# EAGLE design SkyKontrol-smartDisplay (EAGLE 9.5.2)
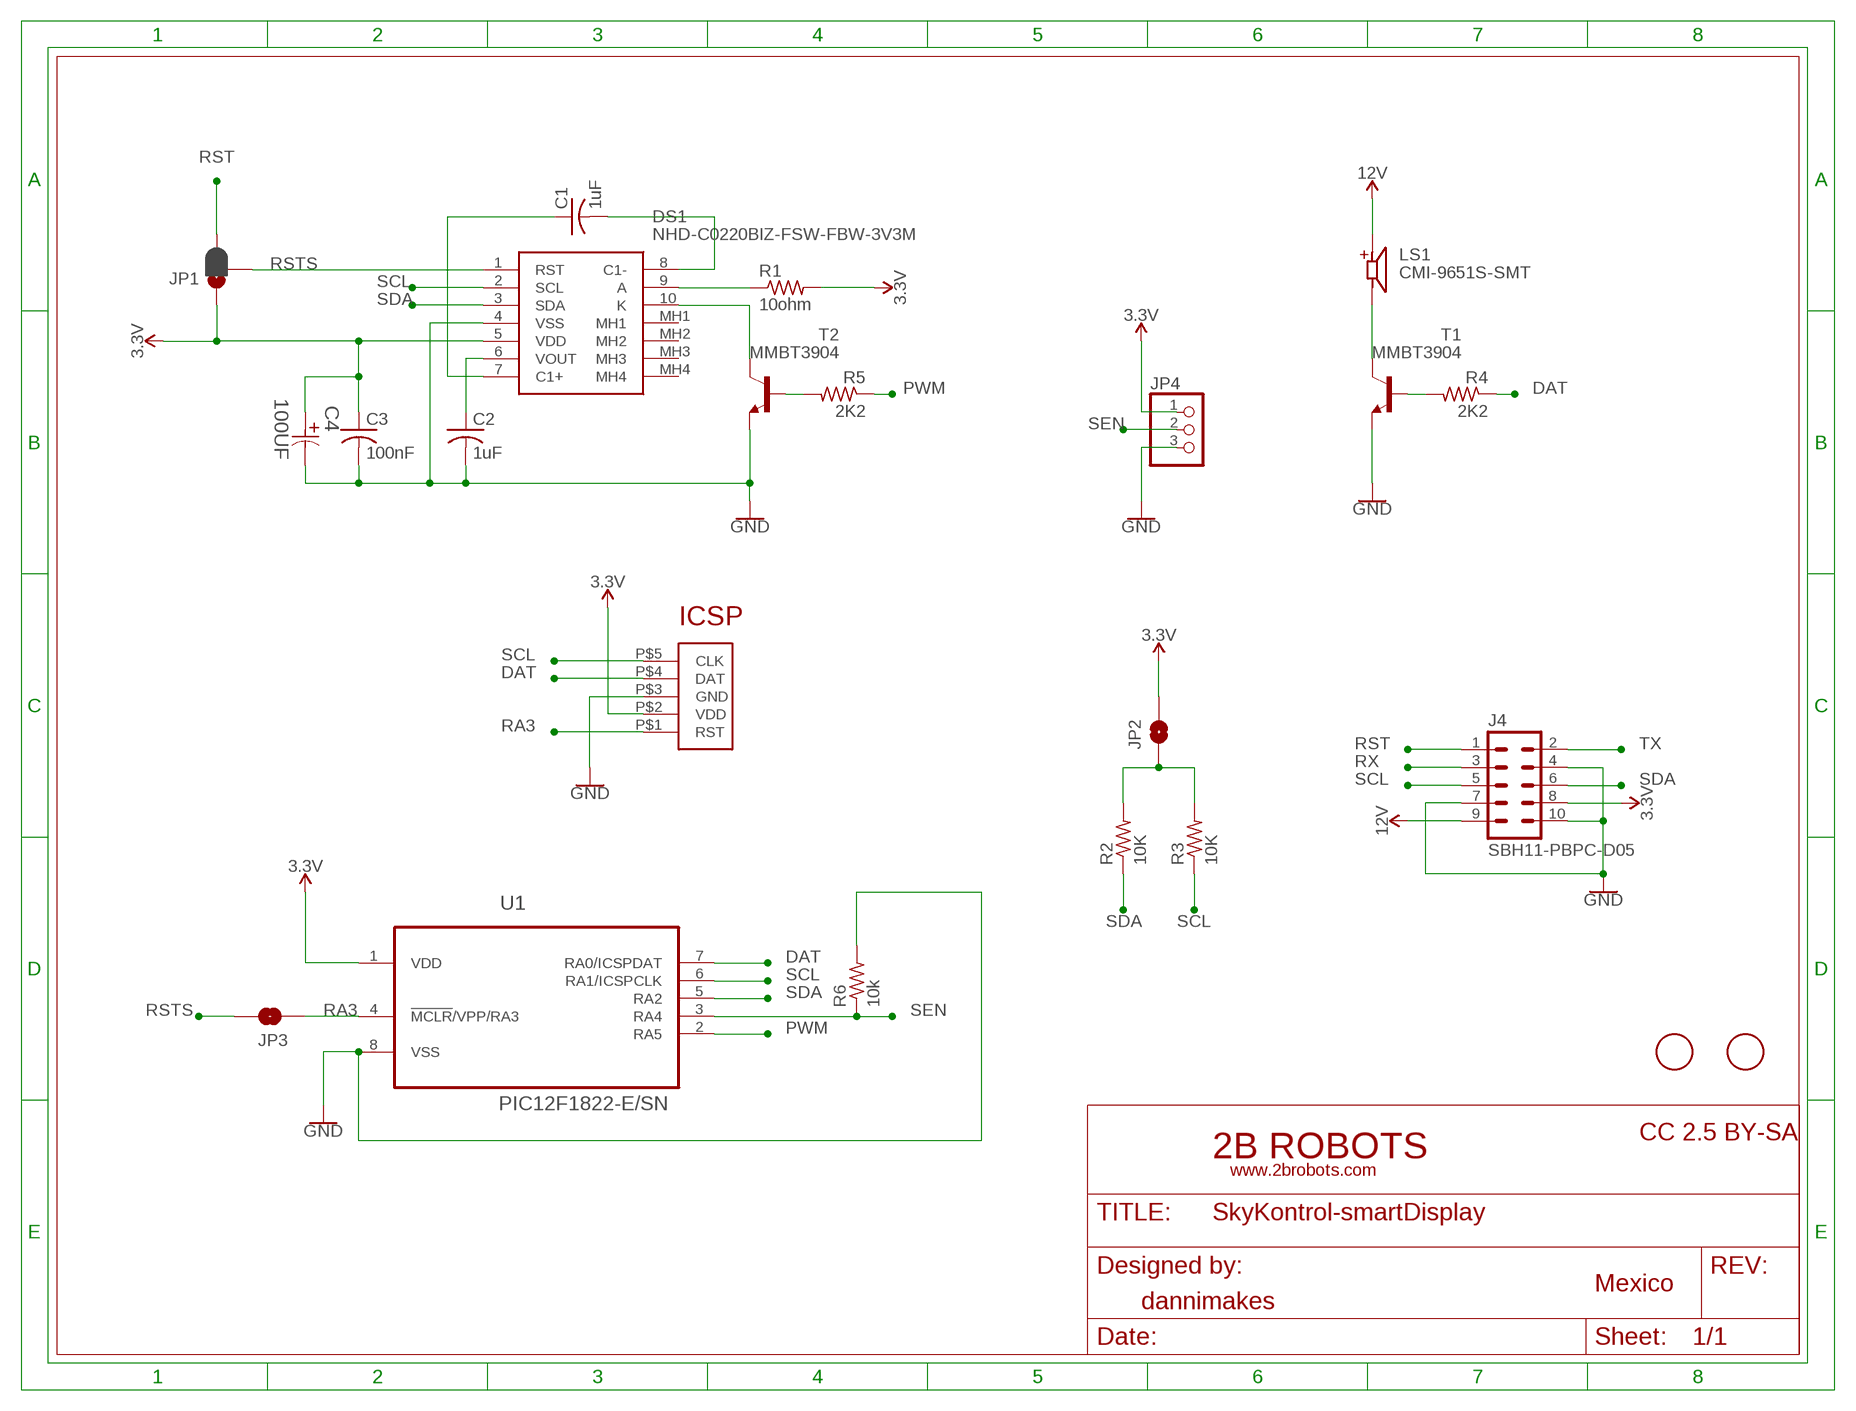
[diagram p0: schematic, sheet 1]

## Parts
C1  1uF  C-USC0603K  [C0603K]
C2  1uF  C-USC0603K  [C0603K]
C3  100nF  C-USC0603K  [C0603K]
C4  100UF  EEE-HA1E101XP-CASE-D8  [CAPAE660X800N]
DS1  NHD-C0220BIZ-FSW-FBW-3V3M  [NHDC0220BIZFSWFBW3V3M]
J4  SBH11-PBPC-D05  [SBH11-PBPC-D05]
JP1  JUMPER-SMT_3_1-NC_PASTE_SILK  [SMT-JUMPER_3_1-NC_PASTE_SILK]
JP2  JUMPER-SMT_2_NO_SILK  [SMT-JUMPER_2_NO_SILK]
JP3  JUMPER-SMT_2_NO_SILK  [SMT-JUMPER_2_NO_SILK]
JP4  PINHD-1X3CB  [1X03-CLEANBIG]
LS1  CMI-9651S-SMT  [CUI_CMI-9651S-SMT]
R1  10ohm  R-US_R0805  [R0805]
R2  10K  R-US_R0805  [R0805]
R3  10K  R-US_R0805  [R0805]
R4  2K2  R-US_R0805  [R0805]
R5  2K2  R-US_R0805  [R0805]
R6  10k  R-US_R0805  [R0805]
T1  MMBT3904  MMBT3904LT1-NPN-SOT23-BEC  [SOT23-BEC]
T2  MMBT3904  MMBT3904LT1-NPN-SOT23-BEC  [SOT23-BEC]
U1  PIC12F1822-E/SN  [SOIC127P600X175-8N]
U$1  FIDUCIAL  [FIDUCIAL_1MM]
U$2  ICSP_POGO  [ICSP_POGO]
U$3  FIDUCIAL  [FIDUCIAL_1MM]

## Nets
3.3V: C3.1 C4.1 DS1.5(VDD) J4.8 JP1.1 JP2.2 JP4.1 R1.2 U1.1(VDD) U$2.P$2(VDD)
12V: J4.9 LS1.P
DAT: R4.1 U1.7(RA0/ICSPDAT) U$2.P$4(DAT)
GND: C2.2 C3.2 C4.2 DS1.4(VSS) J4.4 J4.7 J4.10 JP4.3 R6.2 T1.E T2.E U1.8(VSS) U$2.P$3(GND)
N$1: C2.1 DS1.6(VOUT)
N$2: C1.2 DS1.8(C1-)
N$3: C1.1 DS1.7(C1+)
N$4: DS1.9(A) R1.1
N$8: JP2.1 R2.2 R3.2
N$10: LS1.N T1.C
N$12: R4.2 T1.B
N$17: DS1.10(K) T2.C
N$19: R5.2 T2.B
PWM: R5.1 U1.2(RA5)
RA3: JP3.1 U1.4(!MCLR!/VPP/RA3) U$2.P$1(RST)
RST: J4.1 JP1.3
RSTS: DS1.1(RST) JP1.2 JP3.2
RX: J4.3
SCL: DS1.2(SCL) J4.5 R3.1 U1.6(RA1/ICSPCLK) U$2.P$5(CLK)
SDA: DS1.3(SDA) J4.6 R2.1 U1.5(RA2)
SEN: JP4.2 R6.1 U1.3(RA4)
TX: J4.2
Unconnected: DS1.MH1 DS1.MH2 DS1.MH3 DS1.MH4

## Library data of the parts
C1-C3 = adafruit:C-US: CAPACITOR, American symbol
C4 = Panasonic-EEEFT_EEEH:EEE-: Aluminum Electrolytic Capacitors,Surface Mount Type; MPN: EEE-HA1E101XP; OC_FARNELL: 1973328; OC_NEWARK: 58T9236; PACKAGE: CASE-D8; SUPPLIER: PANASONIC; TOLERANCE: ±20 %; VOLTAGERATING: 25V
DS1 = NHD-C0220BIZ-FSW-FBW-3V3M:NHD-C0220BIZ-FSW-FBW-3V3M: LCD Character Display Modules & Accessories 2 x 20 FSTN (+) Transf White LED Source: Datasheet <https://componentsearchengine.com/Datasheets/1/NHD-C0220BiZ-FSW-FBW-3V3M.pdf>; DESCRIPTION: LCD Character Display Modules & Accessories 2 x 20 FSTN (+) Transf White LED; HEIGHT: 7mm; MANUFACTURER_NAME: Newhaven Display; MANUFACTURER_PART_NUMBER: NHD-C0220BIZ-FSW-FBW-3V3M; MOUSER_PART_NUMBER: 763-C0220BIZ-FSW-FBW; MOUSER_PRICE-STOCK: https://www.mouser.com/Search/Refine.aspx?Keyword=763-C0220BIZ-FSW-FBW
J4 = con-sullins:SBH11-PBPC-D05: HEADER - Vertical, Shrouded
JP1 = SparkFun-Jumpers:JUMPER-SMT_3_1-NC_PASTE: Normally closed solder jumper (1 of 2 connections) This jumper has an aperture in the stencil to allow solder paste to bridge one of the two connections. One connection is normally closed (NC), while the other is normally open (NO). Wick off the solder to open the connection. Reapply solder to reclose the connection. Apply solder to the other side instead to change the current path.
JP2 JP3 = SparkFun-Jumpers:JUMPER-SMT_2_NO: Normally open jumper This jumper has two pads in close proximity to each other. Apply solder to close the connection. Round pads are easier to solder for beginners, but are a lot larger. SparkFun Product that uses the round pads: SparkFun EL Sequencer <https://www.sparkfun.com/products/12781>
JP4 = adafruit:PINHD-1X3: PIN HEADER
LS1 = CMI-9651S-SMT:CMI-9651S-SMT: 9.6 mm, 12 Vdc, 90 dB, 2.7 kHz, Surface Mount (SMT), Driving Circuit, Magnetic Audio Indicator Buzzer; MANUFACTURER: CUI INC; PARTREV: 1.0; STANDARD: Manufacturer recommendations
R1-R6 = adafruit:R-US_: RESISTOR, American symbol
T1 T2 = transistor:*-NPN-: NPN Transistror BF959 corrected 2008.03.06
U1 = Microchip-PIC12F1822-E_SN:PIC12F1822-E/SN: 8/14-Pin Flash Microcontrollers,SOIC-8; MPN: PIC12F1822-E/SN; OC_FARNELL: 2315760; OC_NEWARK: 53R0195; PACKAGE: SOIC-8; SUPPLIER: Microchip
U$1 U$3 = adafruit:FIDUCIAL: For use by pick and place machines to calibrate the vision/machine, 1mm By microbuilder.eu
U$2 = ICSP_POGO:ICSP_POGO

## Board
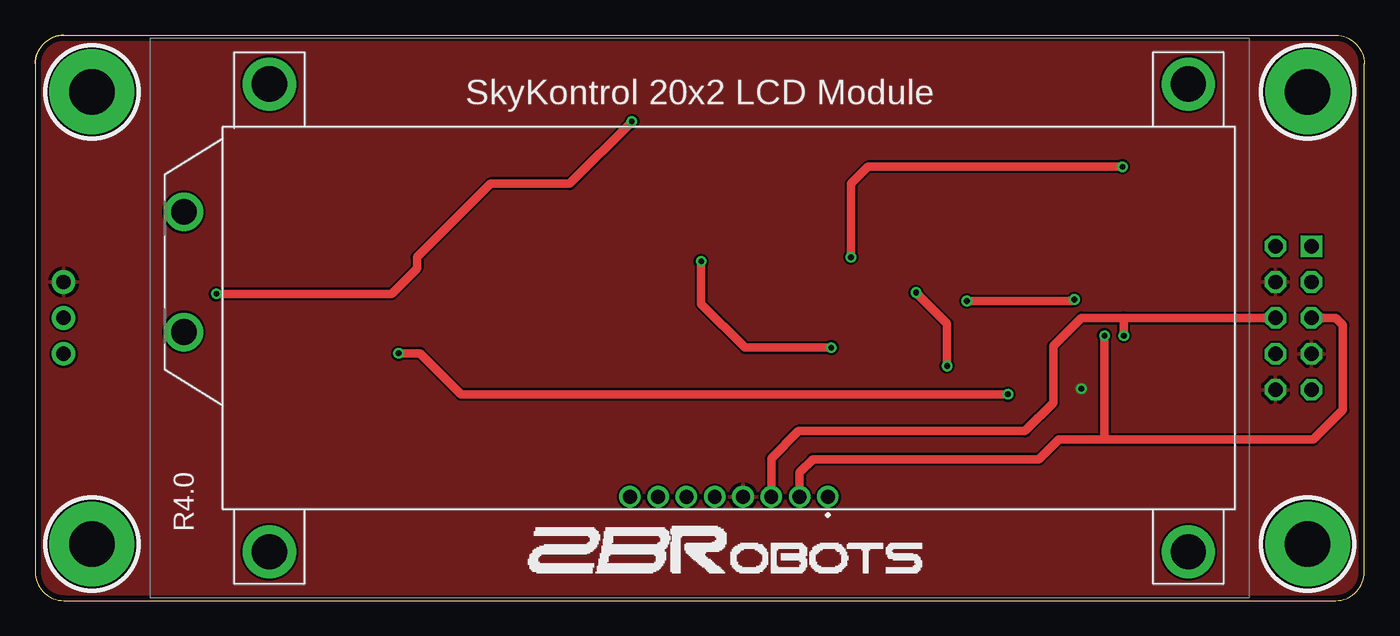
[diagram p1: board, top side]
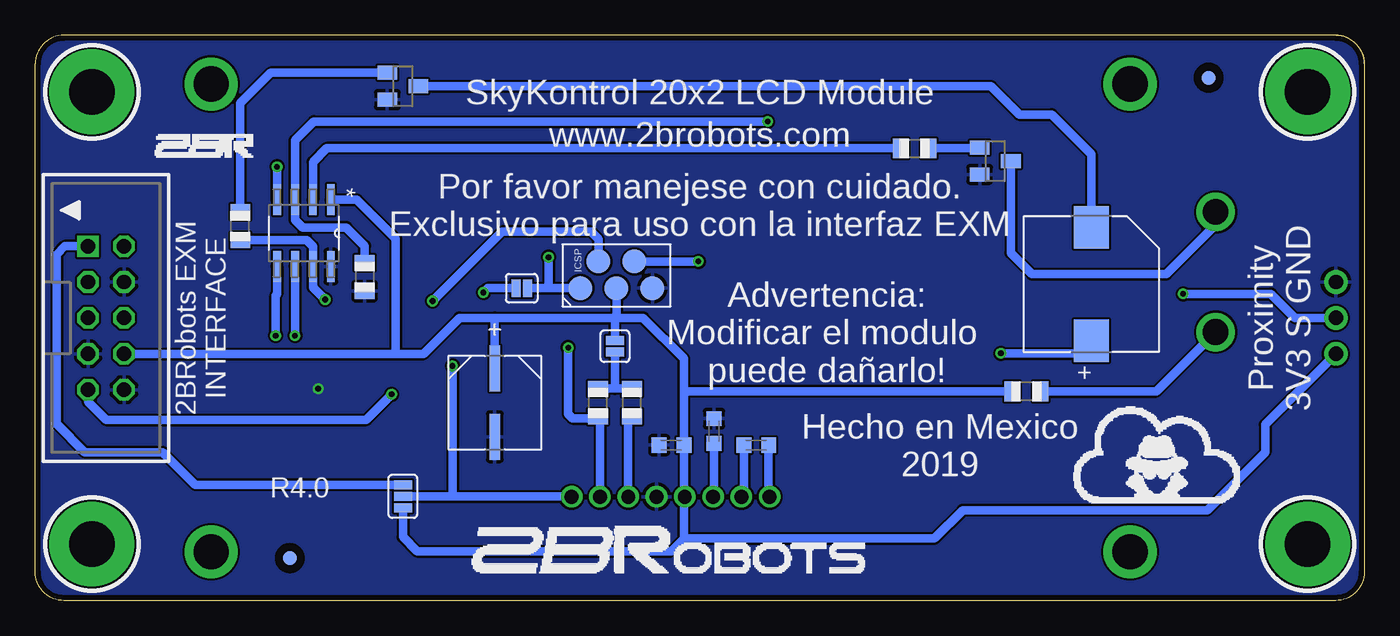
[diagram p2: board, bottom side, seen from below]

Size 94 x 40 mm. Coordinates in mm from the lower left corner, seen from the top.
Outline: 0,38 0,2 arc90 2,0 92,0 arc90 94,2 94,38 arc90 92,40 2,40
Outline: 2,40 arc90 0,38
Outline: 0,38 arc-90 2,40
Copper layers (1*16): Top 0.0356mm / dielectric 1.5011mm / Bottom 0.0356mm
Design rules "2brobots-2layer": minimum track width 6mil, minimum drill 0.3mm, track to track 6mil, track to pad 6mil, pad to pad 6mil, via to via 6mil, smd to smd 6mil, copper to edge 15mil, drill to drill 6mil, minimum pad ring 7mil, minimum via ring 7mil, stop-mask expansion 2.5mil, vias tented up to drill 50mil, thermal gap 10mil

### Footprints (pad centres in the part's own frame; a part is rotated, then mirrored left to right if it is on the bottom)
C0603K = smd 1.05 x 1.08: 1 -0.875,0; 2 0.875,0
CAPAE660X800N = smd 3.251 x 0.762: 1 -2.413,0; 2 2.413,0
NHDC0220BIZFSWFBW3V3M = drill 0.98 pad 1.524: 1 9.058,-12.65; 2 7.058,-12.65; 3 5.058,-12.65; 4 3.058,-12.65; 5 1.058,-12.65; 6 -0.942,-12.65; 7 -2.942,-12.65; 8 -4.942,-12.65 | drill 1.82 pad 2.73: 9 -36.492,-1; 10 -36.492,7.5 | drill 2.5 pad 3.75: MH1 -30.442,-16.55; MH2 34.558,-16.55; MH3 -30.442,16.55; MH4 34.558,16.55
SBH11-PBPC-D05 = drill 1.016 square: 1 -5.08,-1.27 | drill 1.016 octagon: 2 -5.08,1.27; 3 -2.54,-1.27; 4 -2.54,1.27; 5 0,-1.27; 6 0,1.27; 7 2.54,-1.27; 8 2.54,1.27; 9 5.08,-1.27; 10 5.08,1.27
SMT-JUMPER_3_1-NC_PASTE_SILK = smd 0.635 x 1.27: 1 -0.813,0; 2 0,0; 3 0.813,0
SMT-JUMPER_2_NO_SILK = smd 0.635 x 1.27: 1 -0.406,0; 2 0.406,0
1X03-CLEANBIG = drill 1.016 pad 1.676: 1 -2.54,0; 2 0,0; 3 2.54,0
CUI_CMI-9651S-SMT = smd 3 x 2.5: N 4,0; P -4,0
R0805 = smd 1.1 x 1.4: 1 -1,0; 2 1,0
SOT23-BEC = smd 1 x 1.4: B -0.95,-1.1; C 0,1.1; E 0.95,-1.1
SOIC127P600X175-8N = smd 2.184 x 0.559: 1 -2.362,1.905; 2 -2.362,0.635; 3 -2.362,-0.635; 4 -2.362,-1.905; 5 2.362,-1.905; 6 2.362,-0.635; 7 2.362,0.635; 8 2.362,1.905
FIDUCIAL_1MM = smd 1 x 1: 1 0,0
ICSP_POGO = smd 1.7 x 1.7: P$1 -2.55,0; P$2 0,0; P$3 2.55,0; P$4 -1.275,1.9; P$5 1.275,1.9

### Placement (x,y rotation side)
C1  43,11 0 bottom
C2  46,12 90 bottom
C3  49,11 180 bottom
C4  61.5,14 270 bottom
DS1  47,20 0 top
J4  89,20 270 bottom
JP1  68,7.38 90 bottom
JP2  53,18 90 bottom
JP3  59.6,22.1 180 bottom
JP4  2,20 90 top
LS1  19.3,22.4 90 bottom
R1  23.9,14.8 180 bottom
R2  51.8,14 90 bottom
R3  54.2,14 90 bottom
R4  79.5,26.5 90 bottom
R5  31.8,32 0 bottom
R6  70.7,22.9 270 bottom
T1  68,36.4 270 bottom
T2  26.1,31.1 270 bottom
U1  75,26 270 bottom
U$1  11,37 0 bottom
U$2  52.9,22.1 0 bottom
U$3  76,3 0 bottom

### Tracks (layer width: path | path; a pad name or v marks a point on that pad's centre or on a via)
3.3V
  Bottom 0.61: 48.12,7.42 C3.1 48.12,14.8 | 48.12,7.42 DS1.5 | 53,20 51,20 48.12,17.12 48.12,14.8 | JP2.2 53,20 | J4.8 68.5,17.46 | 68.5,17.46 66.54,17.46 64,20 61.5,20 | 61.5,20 53,20 | JP1.1 68,4.5 67,3.5 49,3.5 48.12,4.38 | 48.12,4.38 48.12,7.42 | C4.1 61.5,20 | R1.2 48.12,14.8 | U1.1 71.26,28.36 68.5,25.6 68.5,17.46 | JP4.1 7,12.46 7,10.5 11.1,6.4 28.4,6.4 30.4,4.4 48.1,4.4 48.12,4.38 | U$2.P$2 52.89,20.11 53,20
12V  (via drill 0.4)
  Top 0.61: v68.8,14.6 30.1,14.6 27.2,17.5 v25.7,17.5
  Bottom 0.61: J4.9 90.27,14.07 89,12.8 70.6,12.8 v68.8,14.6 | v25.7,17.5 19.5,17.5 19.4,17.4 19.3,17.5 LS1.P
DAT  (via drill 0.4)
  Top 0.61: v65.9,21.2 73.4,21.2 v73.5,21.3
  Bottom 0.61: R4.1 74.8,25.5 74.36,25.07 U1.7 74.36,22.16 v73.5,21.3 | U$2.P$4 54.17,25.57 54.7,26.1 61,26.1 v65.9,21.2
GND  (via drill 0.4)
  other vias: 74,15
  pour Top: 0,0 94,0 94,40 0,40
  pour Bottom: 0,0 94,0 94,40 0,40
N$1
  Bottom 0.61: C2.1 46,7.41 DS1.6
N$2
  Bottom 0.61: C1.2 42.12,7.42 DS1.8
N$3
  Bottom 0.61: C1.1 43.88,7.53 DS1.7
N$4
  Bottom 0.61: R1.1 14.71,14.8 DS1.9
N$5  (via drill 3.2 pad 6)
  other vias: 90,36
N$6  (via drill 3.2 pad 6)
  other vias: 4,36
N$7  (via drill 3.2 pad 6)
  other vias: 4,4
N$8
  Bottom 0.61: R2.2 53,15 | 53,15 R3.2 | 53,15 JP2.1
N$10
  Bottom 0.61: T1.C 26.4,36.4 24.4,34.4 22.1,34.4 19.3,31.6 LS1.N
N$11  (via drill 3.2 pad 6)
  other vias: 90,4
N$12
  Bottom 0.61: T1.B 77.35,37.35 79.5,35.2 R4.2
N$17
  Bottom 0.61: T2.C 25,24.6 23.5,23.1 14,23.1 10.51,26.59 DS1.10
N$19
  Bottom 0.61: T2.B 27.25,32 R5.2
PWM
  Bottom 0.61: U1.2 74.36,31.04 73.4,32 R5.1
RA3  (via drill 0.4)
  Top 0.61: v76.9,30.7 58.9,30.7 57.7,29.5 v57.7,24.3
  Bottom 0.61: JP3.1 57.7,22.1 | 57.7,22.1 U$2.P$1 | U1.4 v76.91,30.7 v76.9,30.7 | v57.7,24.3 57.7,22.1
RST
  Bottom 0.61: J4.1 91.92,25.08 92.5,24.5 92.5,12.5 90.5,10.5 85,10.5 82.69,8.19 JP1.3
RSTS  (via drill 0.4)
  Top 0.61: v62.3,21.8 64.5,19.6 v64.5,16.6
  Bottom 0.61: JP1.2 64.6,7.38 | 64.6,7.38 56.08,7.38 DS1.1 | JP3.2 62,22.1 v62.3,21.8 | v64.5,16.6 64.5,7.47 64.6,7.38
SCL  (via drill 0.4)
  Top 0.61: J4.5 92,20 92.5,19.5 92.5,13.5 90.4,11.4 75.64,11.4 | 75.64,11.4 72.4,11.4 71,10 55,10 54.06,9.06 DS1.2 | v75.64,18.75 75.64,11.4 | v47.1,24 47.1,21 50.2,17.9 v56.3,17.9
  Bottom 0.61: DS1.2 54.06,12.94 R3.1 54.3,12.9 56,12.9 56.3,13.2 v56.3,17.9 | U1.6 v75.64,18.75 | U$2.P$5 v47.1,24
SDA  (via drill 0.4)
  Top 0.61: 77,20 74,20 72,18 72,14 70,12 54,12 52.06,10.06 DS1.3 | 77,20 J4.6 | v77,18.75 77,20
  Bottom 0.61: R2.1 52.06,12.94 DS1.3 | U1.5 76.91,21.7 77,21.6 v77,18.75
SEN  (via drill 0.4)
  Top 0.61: v42.2,33.9 37.8,29.5 32.2,29.5 27,24.3 27,23.5 25.2,21.7 v12.8,21.7
  Bottom 0.61: R6.1 70.7,25.1 72,26.4 75.1,26.4 75.64,26.93 U1.3 75.64,32.56 74.3,33.9 v42.2,33.9 | v12.8,21.7 6.6,21.7 4.9,20 JP4.2

### Text on the board
tPlace: SkyKontrol 20x2 LCD Module | R4.0
bPlace: SkyKontrol 20x2 LCD Module | www.2brobots.com | Por favor manejese con cuidado. / Exclusivo para uso con la interfaz EXM | Proximity / 3V3 S GND | 2BRobots EXM / INTERFACE | Advertencia: / Modificar el modulo / puede dañarlo! | Hecho en Mexico / 2019 | R4.0
tStop: 2brobots.com